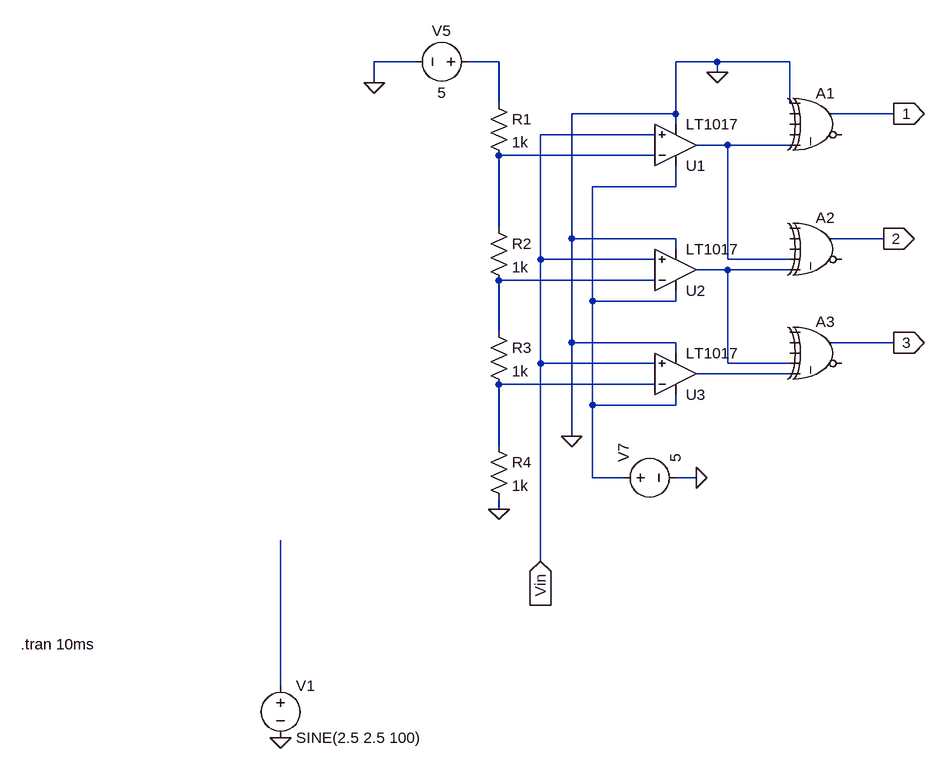
[diagram p0: schematic 4bitsComparator.asc]
4bitsComparator.asc, the LTspice schematic file:
Version 4
SHEET 1 2344 1640
WIRE 848 256 784 256
WIRE 976 256 928 256
WIRE 1312 256 1248 256
WIRE 1424 256 1312 256
WIRE 1312 272 1312 256
WIRE 784 288 784 256
WIRE 976 320 976 256
WIRE 1424 320 1424 256
WIRE 1248 336 1248 256
WIRE 1248 336 1088 336
WIRE 1584 336 1488 336
WIRE 1248 352 1248 336
WIRE 1216 368 1040 368
WIRE 1328 384 1280 384
WIRE 1424 384 1328 384
WIRE 1216 400 976 400
WIRE 1248 448 1248 416
WIRE 1248 448 1120 448
WIRE 976 512 976 400
WIRE 1088 528 1088 336
WIRE 1248 528 1088 528
WIRE 1568 528 1488 528
WIRE 1248 544 1248 528
WIRE 1040 560 1040 368
WIRE 1216 560 1040 560
WIRE 1328 560 1328 384
WIRE 1424 560 1328 560
WIRE 1328 576 1280 576
WIRE 1424 576 1328 576
WIRE 1216 592 976 592
WIRE 1120 624 1120 448
WIRE 1248 624 1248 608
WIRE 1248 624 1120 624
WIRE 976 672 976 592
WIRE 1088 688 1088 528
WIRE 1248 688 1088 688
WIRE 1584 688 1488 688
WIRE 1248 704 1248 688
WIRE 1040 720 1040 560
WIRE 1216 720 1040 720
WIRE 1328 720 1328 576
WIRE 1424 720 1328 720
WIRE 1424 736 1280 736
WIRE 1216 752 976 752
WIRE 1120 784 1120 624
WIRE 1248 784 1248 768
WIRE 1248 784 1120 784
WIRE 1088 832 1088 688
WIRE 976 848 976 752
WIRE 1120 896 1120 784
WIRE 1168 896 1120 896
WIRE 1280 896 1248 896
WIRE 976 944 976 928
WIRE 1040 1024 1040 720
WIRE 640 1216 640 992
FLAG 1312 272 0
FLAG 1280 896 0
FLAG 1584 688 3
IOPIN 1584 688 Out
FLAG 1568 528 2
IOPIN 1568 528 Out
FLAG 1584 336 1
IOPIN 1584 336 Out
FLAG 784 288 0
FLAG 976 944 0
FLAG 1040 1024 Vin
IOPIN 1040 1024 In
FLAG 640 1296 0
FLAG 1088 832 0
SYMBOL res 960 304 R0
SYMATTR InstName R1
SYMATTR Value 1k
SYMBOL voltage 944 256 R90
WINDOW 0 -32 56 VBottom 2
WINDOW 3 32 56 VTop 2
WINDOW 123 0 0 Left 0
WINDOW 39 0 0 Left 0
SYMATTR InstName V5
SYMATTR Value 5
SYMBOL res 960 496 R0
SYMATTR InstName R2
SYMATTR Value 1k
SYMBOL res 960 656 R0
SYMATTR InstName R3
SYMATTR Value 1k
SYMBOL voltage 1152 896 R270
WINDOW 123 0 0 Left 0
WINDOW 39 0 0 Left 0
SYMATTR InstName V7
SYMATTR Value 5
SYMBOL res 960 832 R0
SYMATTR InstName R4
SYMATTR Value 1k
SYMBOL Digital\\xor 1472 288 R0
SYMATTR InstName A1
SYMBOL Digital\\xor 1472 480 R0
SYMATTR InstName A2
SYMBOL Digital\\xor 1472 640 R0
SYMATTR InstName A3
SYMBOL voltage 640 1200 R0
WINDOW 123 0 0 Left 0
WINDOW 39 0 0 Left 0
SYMATTR InstName V1
SYMATTR Value SINE(2.5 2.5 100)
SYMBOL Comparators\\LT1017 1248 384 M180
SYMATTR InstName U1
SYMBOL Comparators\\LT1017 1248 576 M180
SYMATTR InstName U2
SYMBOL Comparators\\LT1017 1248 736 M180
SYMATTR InstName U3
TEXT 240 1152 Left 2 !.tran 10ms

The netlist it stands for:
* 4bitsComparator.asc
R1 N001 N003 1k
V5 N001 0 5
R2 N003 N006 1k
R3 N006 N008 1k
V7 N004 0 5
R4 N008 0 1k
A1 0 0 0 0 N002 0 1 0 XOR
A2 0 0 0 N002 N005 0 2 0 XOR
A3 0 0 0 N005 N007 0 3 0 XOR
V1 N009 0 SINE(2.5 2.5 100)
XU1 Vin N003 N004 0 N002 LT1017  ; pins In+ In- V+ V- OUT
XU2 Vin N006 N004 0 N005 LT1017  ; pins In+ In- V+ V- OUT
XU3 Vin N008 N004 0 N007 LT1017  ; pins In+ In- V+ V- OUT
.tran 10ms
.backanno
.end